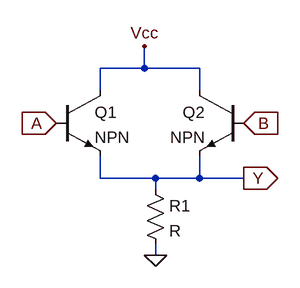
[diagram p0: schematic OR.asc]
OR.asc, the LTspice schematic file:
Version 4
SHEET 1 880 680
WIRE 208 96 208 64
WIRE 208 96 144 96
WIRE 288 96 208 96
WIRE 144 128 144 96
WIRE 288 128 288 96
WIRE 144 256 144 224
WIRE 224 256 144 256
WIRE 288 256 288 224
WIRE 288 256 224 256
WIRE 352 256 288 256
WIRE 224 272 224 256
WIRE 224 368 224 352
FLAG 80 176 A
IOPIN 80 176 In
FLAG 352 176 B
IOPIN 352 176 In
FLAG 352 256 Y
IOPIN 352 256 Out
FLAG 208 64 Vcc
FLAG 224 368 0
SYMBOL npn 80 128 R0
SYMATTR InstName Q1
SYMBOL npn 352 128 M0
SYMATTR InstName Q2
SYMBOL res 208 256 R0
SYMATTR InstName R1

The netlist it stands for:
* OR.asc
Q1 Vcc A Y 0 NPN
Q2 Vcc B Y 0 NPN
R1 Y 0 R
.model NPN NPN
.model PNP PNP
.lib standard.bjt
.backanno
.end